# Altium schematic sheet micros.SchDoc: PIC-On-The-Go
size A4; DrawnBy: Jarrett Rainier; Revision: 0.2; SheetNumber: 2; SheetTotal: 2
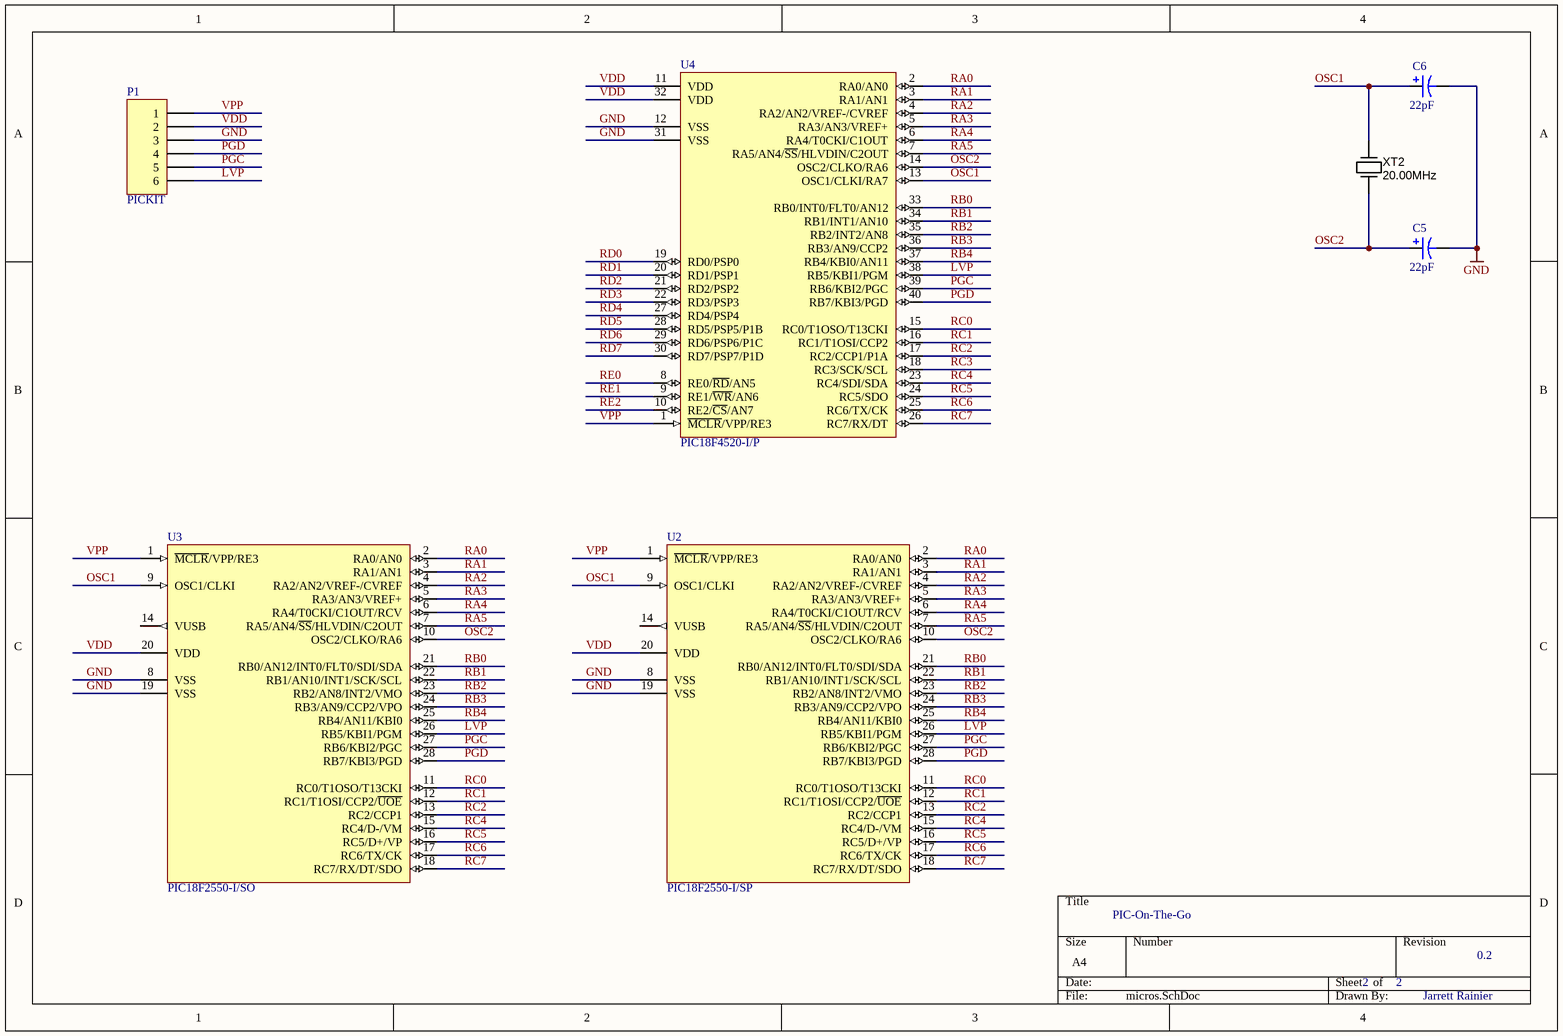
[diagram p0: micros.SchDoc]

## Parts
C5  value 22pF  [C0805]  (hidden comment: Cap Pol3)
C6  value 22pF  [C0805]  (hidden comment: Cap Pol3)
P1  PICKIT  [HDR1X6]
U2  PIC18F2550-I/SP  [SPDIP300-SP28]
U3  PIC18F2550-I/SO  [SOIC-SO28_N]
U4  PIC18F4520-I/P  [PDIP600-P40]
XT2  20.00MHz  [CRYSTAL_HC49-US-SM]

## Nets
GND: C5.2 C6.2 P1.3 U2.8(VSS) U2.19(VSS) U3.8(VSS) U3.19(VSS) U4.12(VSS) U4.31(VSS)
LVP: P1.6 U2.26(RB5/KBI1/PGM) U3.26(RB5/KBI1/PGM) U4.38(RB5/KBI1/PGM)
OSC1: C6.1 U2.9(OSC1/CLKI) U3.9(OSC1/CLKI) U4.13(OSC1/CLKI/RA7) XT2.2(OUT)
OSC2: C5.1 U2.10(OSC2/CLKO/RA6) U3.10(OSC2/CLKO/RA6) U4.14(OSC2/CLKO/RA6) XT2.1(IN)
PGC: P1.5 U2.27(RB6/KBI2/PGC) U3.27(RB6/KBI2/PGC) U4.39(RB6/KBI2/PGC)
PGD: P1.4 U2.28(RB7/KBI3/PGD) U3.28(RB7/KBI3/PGD) U4.40(RB7/KBI3/PGD)
RA0: U2.2(RA0/AN0) U3.2(RA0/AN0) U4.2(RA0/AN0)
RA1: U2.3(RA1/AN1) U3.3(RA1/AN1) U4.3(RA1/AN1)
RA2: U2.4(RA2/AN2/VREF-/CVREF) U3.4(RA2/AN2/VREF-/CVREF) U4.4(RA2/AN2/VREF-/CVREF)
RA3: U2.5(RA3/AN3/VREF+) U3.5(RA3/AN3/VREF+) U4.5(RA3/AN3/VREF+)
RA4: U2.6(RA4/T0CKI/C1OUT/RCV) U3.6(RA4/T0CKI/C1OUT/RCV) U4.6(RA4/T0CKI/C1OUT)
RA5: U2.7(RA5/AN4/~{SS}/HLVDIN/C2OUT) U3.7(RA5/AN4/~{SS}/HLVDIN/C2OUT) U4.7(RA5/AN4/~{SS}/HLVDIN/C2OUT)
RB0: U2.21(RB0/AN12/INT0/FLT0/SDI/SDA) U3.21(RB0/AN12/INT0/FLT0/SDI/SDA) U4.33(RB0/INT0/FLT0/AN12)
RB1: U2.22(RB1/AN10/INT1/SCK/SCL) U3.22(RB1/AN10/INT1/SCK/SCL) U4.34(RB1/INT1/AN10)
RB2: U2.23(RB2/AN8/INT2/VMO) U3.23(RB2/AN8/INT2/VMO) U4.35(RB2/INT2/AN8)
RB3: U2.24(RB3/AN9/CCP2/VPO) U3.24(RB3/AN9/CCP2/VPO) U4.36(RB3/AN9/CCP2)
RB4: U2.25(RB4/AN11/KBI0) U3.25(RB4/AN11/KBI0) U4.37(RB4/KBI0/AN11)
RC0: U2.11(RC0/T1OSO/T13CKI) U3.11(RC0/T1OSO/T13CKI) U4.15(RC0/T1OSO/T13CKI)
RC1: U2.12(RC1/T1OSI/CCP2/~{UOE}) U3.12(RC1/T1OSI/CCP2/~{UOE}) U4.16(RC1/T1OSI/CCP2)
RC2: U2.13(RC2/CCP1) U3.13(RC2/CCP1) U4.17(RC2/CCP1/P1A)
RC3: U4.18(RC3/SCK/SCL)
RC4: U2.15(RC4/D-/VM) U3.15(RC4/D-/VM) U4.23(RC4/SDI/SDA)
RC5: U2.16(RC5/D+/VP) U3.16(RC5/D+/VP) U4.24(RC5/SDO)
RC6: U2.17(RC6/TX/CK) U3.17(RC6/TX/CK) U4.25(RC6/TX/CK)
RC7: U2.18(RC7/RX/DT/SDO) U3.18(RC7/RX/DT/SDO) U4.26(RC7/RX/DT)
RD0: U4.19(RD0/PSP0)
RD1: U4.20(RD1/PSP1)
RD2: U4.21(RD2/PSP2)
RD3: U4.22(RD3/PSP3)
RD4: U4.27(RD4/PSP4)
RD5: U4.28(RD5/PSP5/P1B)
RD6: U4.29(RD6/PSP6/P1C)
RD7: U4.30(RD7/PSP7/P1D)
RE0: U4.8(RE0/~{RD}/AN5)
RE1: U4.9(RE1/~{WR}/AN6)
RE2: U4.10(RE2/~{CS}/AN7)
VDD: P1.2 U2.20(VDD) U3.20(VDD) U4.11(VDD) U4.32(VDD)
VPP: P1.1 U2.1(~{MCLR}/VPP/RE3) U3.1(~{MCLR}/VPP/RE3) U4.1(~{MCLR}/VPP/RE3)

Not connected (* = marked no-connect by the designer): U2 14(VUSB); U3 14(VUSB)

## Library data of the parts
C5 C6 = Cap Pol3: Polarized Capacitor (Surface Mount); Published: 8-Jun-2000; LatestRevisionDate: 29-May-2009; LatestRevisionNote: IPC-7351 Footprint Added.; PackageReference: C0805; Publisher: Altium Limited; PackageDescription: Chip Capacitor; Supplier Part Number 1: *
P1 = Header 6: Header, 6-Pin; LatestRevisionDate: 17-Jul-2002; LatestRevisionNote: Re-released for DXP Platform.; Publisher: Altium Limited
U2 = PIC18F2550-I/SP: High Performance, Enhanced Flash, USB Microcontroller with nanoWatt Technology, 32K Flash, 28-Pin SPDIP, Industrial Temperature Range; Published: 29-Jan-2009; LatestRevisionDate: 02-Dec-2009; LatestRevisionNote: Updated to datasheet revision E, Aug-2008; DatasheetVersion: revE, Aug-2008; PackageVersion: revBB, Aug-2009; PackageReference: SPDIP300-SP28; Publisher: Altium Limited; PackageDescription: 28-Lead Skinny Plastic Dual In-Line (SP) - 300 mil Body [SPDIP]; Supplier 1: Digi-Key; Supplier Part Number 1: PIC18F2550-I/SP-ND; Supplier 2: Farnell; Supplier Part Number 2: 9321250; Supplier 3: Farnell; Supplier Part Number 3: 1523822; ComponentLink1Description: Datasheet; ComponentLink1URL: http://ww1.microchip.com/downloads/en/DeviceDoc/39632e.pdf; ComponentLink2Description: Packaging Specification; ComponentLink2URL: http://www.microchip.com/stellent/groups/techpub_sg/documents/packagingspec/en012702.pdf; ComponentLink3Description: Microchip.com Home; ComponentLink3URL: http://www.microchip.com/
U3 = PIC18F2550-I/SO: High Performance, Enhanced Flash, USB Microcontroller with nanoWatt Technology, 32K Flash, 28-Pin SOIC, Industrial Temperature Range; Published: 29-Jan-2009; LatestRevisionDate: 02-Dec-2009; LatestRevisionNote: Updated to datasheet revision E, Aug-2008; DatasheetVersion: revE, Aug-2008; PackageVersion: revBB, Aug-2009; PackageReference: SOIC-SO28; Publisher: Altium Limited; PackageDescription: 28-Lead Plastic Small Outline (SO) - Wide 7.50mm Body [SOIC]; Supplier 1: Digi-Key; Supplier Part Number 1: PIC18F2550-I/SO-ND; Supplier 2: Farnell; Supplier Part Number 2: 1660053; Supplier 3: Farnell; Supplier Part Number 3: 9321268; Code_JEDEC: MS-013; ComponentLink1Description: Datasheet; ComponentLink1URL: http://ww1.microchip.com/downloads/en/DeviceDoc/39632e.pdf; ComponentLink2Description: Packaging Specification; ComponentLink2URL: http://www.microchip.com/stellent/groups/techpub_sg/documents/packagingspec/en012702.pdf; ComponentLink3Description: Microchip.com Home; ComponentLink3URL: http://www.microchip.com/
U4 = PIC18F4520-I/P: Enhanced Flash Microcontroller with 10-Bit A/D and nanoWatt Technology, 32K Flash, 40-Pin PDIP, Industrial Temperature Range; Published: 29-Jan-2009; LatestRevisionDate: 02-Dec-2009; LatestRevisionNote: Updated to datasheet revision E, Oct-2008; DatasheetVersion: revE, Oct-2008; PackageVersion: revBB, Aug-2009; PackageReference: PDIP600-P40; Publisher: Altium Limited; PackageDescription: 40-Lead Plastic Dual In-Line (P) - 600 mil Body [PDIP]; Supplier 1: Digi-Key; Supplier Part Number 1: PIC18F4520-I/P-ND; Supplier 2: Farnell; Supplier Part Number 2: 1523812; Supplier 3: Farnell; Supplier Part Number 3: 1212702; ComponentLink1Description: Datasheet; ComponentLink1URL: http://ww1.microchip.com/downloads/en/DeviceDoc/39631E.pdf; ComponentLink2Description: Packaging Specification; ComponentLink2URL: http://www.microchip.com/stellent/groups/techpub_sg/documents/packagingspec/en012702.pdf; ComponentLink3Description: Microchip.com Home; ComponentLink3URL: http://www.microchip.com/
XT2 = Crystal_6MHz_HC49/US: Resonator Ceramic 20.00 MHz 30ppm; Manufacturer 1: CTS-Frequency Controls; Manufacturer Part Number 1: ATS060BSM-1; Frequency: 20MHz; Frequency Stability: ±50ppm; Load Capacitance: 18pF; Operating Mode: Fundamental; Parameter Name: 0.169" (4.30mm); SCDType: spec; Package / Case: HC49/US-SM; Ratings: 20.00 MHz; Supplier 1: Digi-Key; Supplier Part Number 1: XC1254CT-ND; Type: MHz Crystal; Frequency Tolerance: ±30ppm; Operating Temperature: -20°C ~ 70°C; Mounting Type: Surface Mount; Size / Dimension: 0.437" L x 0.190" W (11.10mm x 4.83mm); ComponentLink1URL: http://www.ctscorp.com/components/Datasheets/008-0309-0.pdf; ComponentLink1Description: http://www.ctscorp.com/components/Datasheets/008-0309-0.pdf